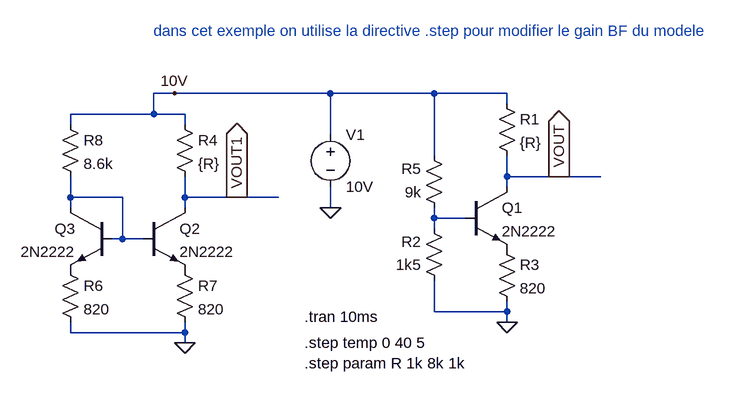
[diagram p0: schematic npn_source_courant.asc]
npn_source_courant.asc, the LTspice schematic file:
Version 4
SHEET 1 880 680
WIRE -416 96 -448 96
WIRE -176 96 -416 96
WIRE -16 96 -176 96
WIRE 96 96 -16 96
WIRE 96 112 96 96
WIRE -448 128 -448 96
WIRE -448 128 -576 128
WIRE -400 128 -448 128
WIRE -576 144 -576 128
WIRE -400 144 -400 128
WIRE -176 160 -176 96
WIRE -16 192 -16 96
WIRE 96 224 96 192
WIRE 176 224 96 224
WIRE 240 224 176 224
WIRE 96 240 96 224
WIRE -576 256 -576 224
WIRE -496 256 -576 256
WIRE -400 256 -400 224
WIRE -320 256 -400 256
WIRE -256 256 -320 256
WIRE -576 272 -576 256
WIRE -400 272 -400 256
WIRE -176 272 -176 240
WIRE -16 288 -16 272
WIRE 32 288 -16 288
WIRE -16 304 -16 288
WIRE -496 320 -496 256
WIRE -496 320 -512 320
WIRE -464 320 -496 320
WIRE -16 432 -16 384
WIRE 96 432 96 416
WIRE 96 432 -16 432
WIRE 96 448 96 432
WIRE -576 464 -576 448
WIRE -400 464 -400 448
WIRE -400 464 -576 464
WIRE -400 480 -400 464
FLAG 96 448 0
FLAG -176 272 0
FLAG 176 224 VOUT
IOPIN 176 224 Out
FLAG -400 480 0
FLAG -320 256 VOUT1
IOPIN -320 256 Out
FLAG -416 96 10V
SYMBOL npn 32 240 R0
SYMATTR InstName Q1
SYMATTR Value 2N2222
SYMBOL res 80 96 R0
SYMATTR InstName R1
SYMATTR Value {R}
SYMBOL voltage -176 144 R0
WINDOW 123 0 0 Left 0
WINDOW 39 0 0 Left 0
SYMATTR InstName V1
SYMATTR Value 10V
SYMBOL res 0 400 R180
WINDOW 0 36 76 Left 0
WINDOW 3 36 40 Left 0
SYMATTR InstName R2
SYMATTR Value 1k5
SYMBOL res 80 320 R0
SYMATTR InstName R3
SYMATTR Value 820
SYMBOL res 0 288 R180
WINDOW 0 36 76 Left 0
WINDOW 3 36 40 Left 0
SYMATTR InstName R5
SYMATTR Value 9k
SYMBOL npn -464 272 R0
SYMATTR InstName Q2
SYMATTR Value 2N2222
SYMBOL res -416 128 R0
SYMATTR InstName R4
SYMATTR Value {R}
SYMBOL res -416 352 R0
SYMATTR InstName R7
SYMATTR Value 820
SYMBOL npn -512 272 M0
SYMATTR InstName Q3
SYMATTR Value 2N2222
SYMBOL res -592 352 R0
SYMATTR InstName R6
SYMATTR Value 820
SYMBOL res -592 128 R0
SYMATTR InstName R8
SYMATTR Value 8.6k
TEXT -216 440 Left 0 !.tran 10ms
TEXT -216 480 Left 0 !.step temp 0 40 5\n.step param R 1k 8k 1k
TEXT -448 0 Left 0 ;dans cet exemple on utilise la directive .step pour modifier le gain BF du modele

The netlist it stands for:
* npn_source_courant.asc
Q1 VOUT N002 P001 0 2N2222
R1 10V VOUT {R}
V1 10V 0 10V
R2 0 N002 1k5
R3 P001 0 820
R5 N002 10V 9k
Q2 VOUT1 N001 P002 0 2N2222
R4 10V VOUT1 {R}
R7 P002 0 820
Q3 N001 N001 P003 0 2N2222
R6 P003 0 820
R8 10V N001 8.6k
.model NPN NPN
.model PNP PNP
.lib standard.bjt
.tran 10ms
.step temp 0 40 5
.step param R 1k 8k 1k
* dans cet exemple on utilise la directive .step pour modifier le gain BF du modele
.backanno
.end